# Altium schematic sheet Display.SchDoc
size A; SheetNumber: 2; SheetTotal: 2
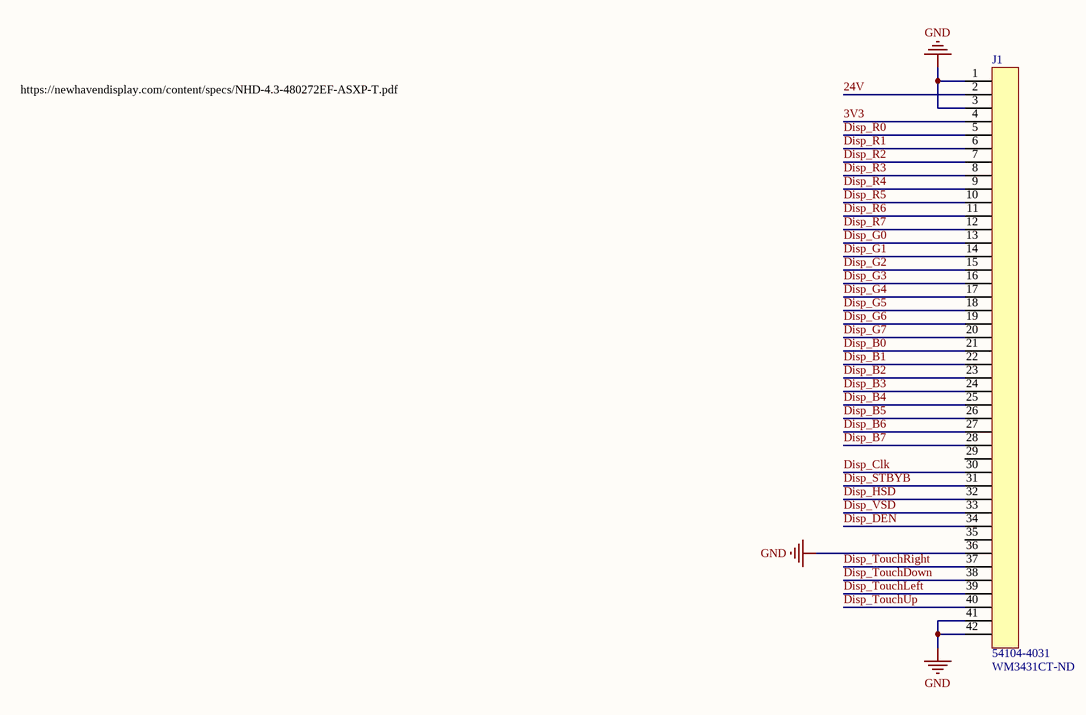
[diagram p0: Display.SchDoc]

## Parts
J1  54104-4031  Supplier Part Number 1: WM3431CT-ND

## Nets
GND: J1.1 J1.3 J1.36 J1.41 J1.42
3V3: J1.4
24V: J1.2
Disp_B0: J1.21
Disp_B1: J1.22
Disp_B2: J1.23
Disp_B3: J1.24
Disp_B4: J1.25
Disp_B5: J1.26
Disp_B6: J1.27
Disp_B7: J1.28
Disp_Clk: J1.30
Disp_DEN: J1.34
Disp_G0: J1.13
Disp_G1: J1.14
Disp_G2: J1.15
Disp_G3: J1.16
Disp_G4: J1.17
Disp_G5: J1.18
Disp_G6: J1.19
Disp_G7: J1.20
Disp_HSD: J1.32
Disp_R0: J1.5
Disp_R1: J1.6
Disp_R2: J1.7
Disp_R3: J1.8
Disp_R4: J1.9
Disp_R5: J1.10
Disp_R6: J1.11
Disp_R7: J1.12
Disp_STBYB: J1.31
Disp_TouchDown: J1.38
Disp_TouchLeft: J1.39
Disp_TouchRight: J1.37
Disp_TouchUp: J1.40
Disp_VSD: J1.33

Not connected (* = marked no-connect by the designer): J1 29 35

## Notes on the sheet
- https://newhavendisplay.com/content/specs/NHD-4.3-480272EF-ASXP-T.pdf

## Library data of the parts
J1 = 54104-4031: Conn FFC/FPC Connector SKT 40 POS 0.5mm Solder RA SMD Easy-On™ T/R; Manufacturer: Molex; Actuator Material: Glass,Polyphenylene; Actuator Color: Brown; Voltage Rating: 50V; Contact Resistance: 20mR; Current Rating: 500mA; Number of Positions: 40; Wire/Cable Type: Straight; Mating Cycles: 20; Contact Location: Top; Gender: Receptacle; Supplier 1: Digi-Key; Manufacturer Part Number: 54104-4031; RoHS: Yes; Category: FFC / FPC; Stock 1: 40667; Pricing 1: 1=3.27, 10=2.879, 100=2.2903 (USD); Mount: Surface Mount; Contact Material: Bronze; Contact Plating: Unplated,Gold; Housing Color: Natural; Housing Material: Nylon; Min Operating Temperature: -20°C; Max Operating Temperature: 85°C; Packaging: Tape and Reel; Number of Rows: 1; Package Quantity: 1500; Termination: Solder; Orientation: Right Angle; Series: 54104; Number of Contacts: 40; Length: 25.5mm; Pitch: 0.5mm; Depth: 5.6mm; Radiation Hardening: No; Flammability Rating: UL94 V-0; RoHS Compliant: Yes; Reach SVHC Compliant: Unknown; ComponentLink1URL: https://datasheet.ciiva.com/671/541045031-sd-671622.pdf?src-supplier=Digi-Key; ComponentLink1Description: https://datasheet.ciiva.com/671/541045031-sd-671622.pdf?src-supplier=Digi-Key; ComponentLink2URL: https://datasheet.ciiva.com/672/541044031-sd-672267.pdf?src-supplier=Digi-Key; ComponentLink2Description: https://datasheet.ciiva.com/672/541044031-sd-672267.pdf?src-supplier=Digi-Key; ComponentLink3URL: https://datasheet.ciiva.com/672/541044031-sd-672268.pdf?src-supplier=Digi-Key; ComponentLink3Description: https://datasheet.ciiva.com/672/541044031-sd-672268.pdf?src-supplier=Digi-Key